# EAGLE design ltc6655LS8_reference_module (EAGLE 7.4.0)
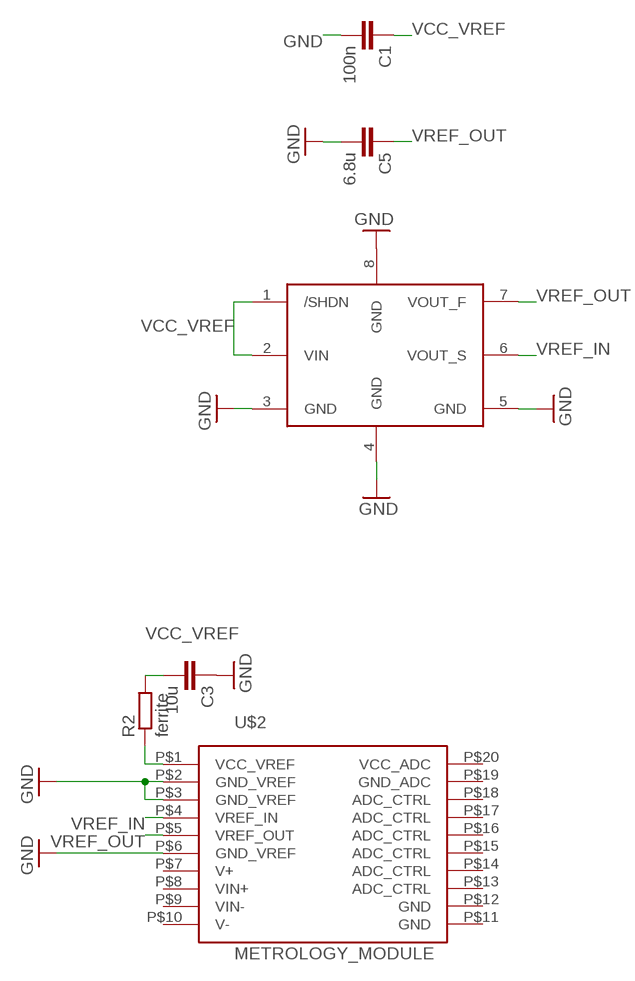
[diagram p0: schematic, sheet 1]

## Parts
C1  100n  C-EUC0603  [C0603]
C3  10u  C-EUC0805  [C0805]
C5  6.8u  C-EU050-085X075W  [C050-085X075W]
R2  ferrite  R-EU_R0805  [R0805]
U$1  LTC6655LS8_ELONG  [LS8_ELONG]
U$2  METROLOGY_MODULE  [METROLOGY_MODULE]

## Nets
GND: C1.2 C3.1 C5.2 U$1.3(GND) U$1.4(GND) U$1.5(GND) U$1.8(GND) U$2.P$2(GND_VREF) U$2.P$3(GND_VREF) U$2.P$6(GND_VREF)
N$1: R2.1 U$2.P$1(VCC_VREF)
VCC_VREF: C1.1 C3.2 R2.2 U$1.1(/SHDN) U$1.2(VIN)
VREF_IN: U$1.6(VOUT_S) U$2.P$4(VREF_IN)
VREF_OUT: C5.1 U$1.7(VOUT_F) U$2.P$5(VREF_OUT)
Unconnected: U$2.P$7(V+) U$2.P$8(VIN+) U$2.P$9(VIN-) U$2.P$10(V-) U$2.P$11(GND) U$2.P$12(GND) U$2.P$13(ADC_CTRL) U$2.P$14(ADC_CTRL) U$2.P$15(ADC_CTRL) U$2.P$16(ADC_CTRL) U$2.P$17(ADC_CTRL) U$2.P$18(ADC_CTRL) U$2.P$19(GND_ADC) U$2.P$20(VCC_ADC)

## Library data of the parts
C1 C3 C5 = SquantorRCL:C-EU: CAPACITOR, European symbol
R2 = SquantorRCL:R-EU_: RESISTOR, European symbol
U$1 = SquantorLinearTechnology:LTC6655
U$2 = SquantorPCBOutline:METROLOGY_MODULE

## Board
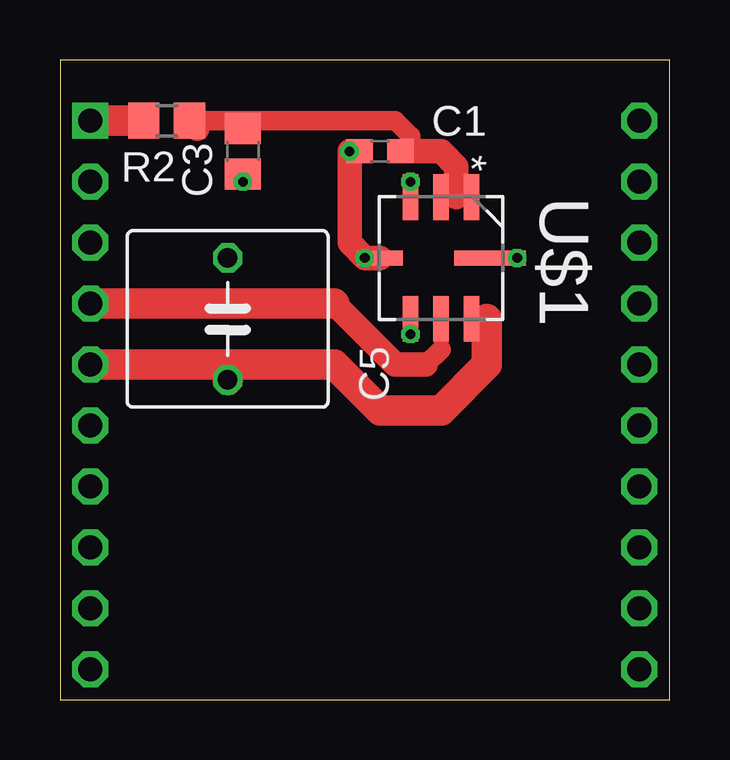
[diagram p1: board, top side]
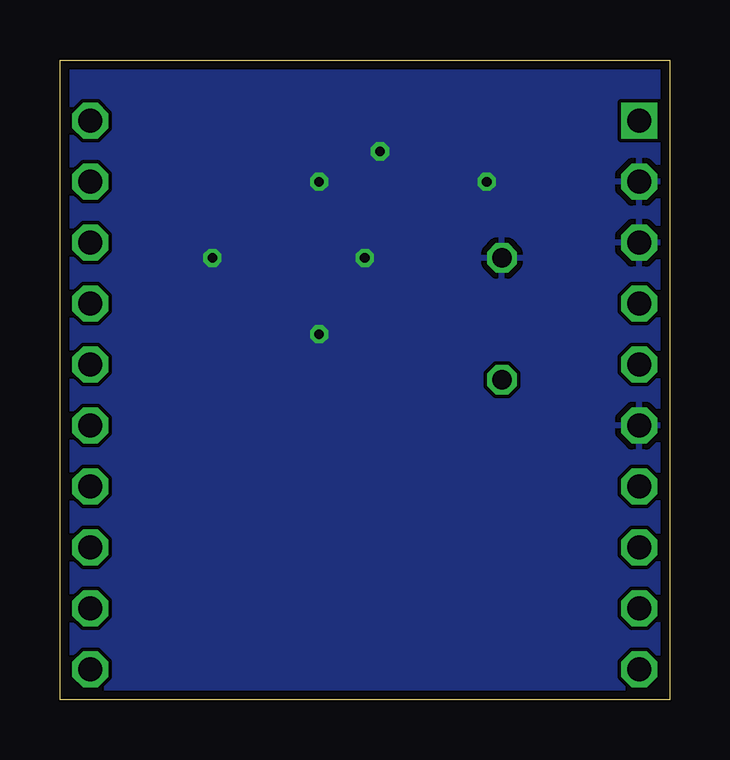
[diagram p2: board, bottom side, seen from below]

Size 25.4 x 26.67 mm. Coordinates in mm from the lower left corner, seen from the top.
Outline: 0,0 25.4,0 25.4,26.67 0,26.67 0,0
Copper layers (1*16): Top 0.0356mm / dielectric 1.5011mm / Bottom 0.0356mm
Design rules "OSHPark": minimum track width 6mil, minimum drill 13mil, track to track 6mil, track to pad 6mil, pad to pad 6mil, via to via 6mil, smd to smd 6mil, copper to edge 15mil, drill to drill 6mil, minimum pad ring 7mil, minimum via ring 7mil, stop-mask expansion 3mil, vias tented up to drill 0mil, thermal gap 10mil

### Footprints (pad centres in the part's own frame; a part is rotated, then mirrored left to right if it is on the bottom)
C0603 = smd 1.1 x 1: 1 -0.85,0; 2 0.85,0
C0805 = smd 1.3 x 1.5: 1 -0.95,0; 2 0.95,0
C050-085X075W = drill 0.813 octagon: 1 -2.54,0; 2 2.54,0
R0805 = smd 1.3 x 1.5: 1 -0.95,0; 2 0.95,0
LS8_ELONG = smd 1.905 x 0.635: 1 -2.54,1.27; 2 -2.54,0; 3 -2.54,-1.27; 5 2.54,-1.27; 6 2.54,0; 7 2.54,1.27 | smd 0.635 x 1.905: 4 0,-2.54 | smd 0.635 x 2.97: 8 0,2.045
METROLOGY_MODULE = drill 1 square: P$1 -11.43,11.43 | drill 1 octagon: P$2 -11.43,8.89; P$3 -11.43,6.35; P$4 -11.43,3.81; P$5 -11.43,1.27; P$6 -11.43,-1.27; P$7 -11.43,-3.81; P$8 -11.43,-6.35; P$9 -11.43,-8.89; P$10 -11.43,-11.43; P$11 11.43,-11.43; P$12 11.43,-8.89; P$13 11.43,-6.35; P$14 11.43,-3.81; P$15 11.43,-1.27; P$16 11.43,1.27; P$17 11.43,3.81; P$18 11.43,6.35; P$19 11.43,8.89; P$20 11.43,11.43

### Placement (x,y rotation side)
C1  13.34,22.86 180 top
C3  7.62,22.86 90 top
C5  6.99,15.88 90 top
R2  4.45,24.13 0 top
U$1  15.88,18.41 270 top
U$2  12.7,12.7 0 top

### Tracks (layer width: path | path; a pad name or v marks a point on that pad's centre or on a via)
GND  (via drill 0.4)
  Top 0.61: U$1.5 v14.61,15.24 | v14.61,21.59 U$1.3 | v19.05,18.41 U$1.8 | C3.1 v7.62,21.59
  Top 0.813: v12.06,22.86 C1.2
  Top 1.016: U$1.4 v12.7,18.41 12.06,19.05 v12.06,22.86
  pour Bottom: 0,26.67 25.4,26.67 25.4,0 0,0
N$1
  Top 1.27: U$2.P$1 R2.1
VCC_VREF
  Top 0.61: U$1.1 16.51,20.95 U$1.2 | C3.2 7.62,24.13
  Top 0.813: 14.61,22.86 14.61,23.5 13.97,24.13 7.62,24.13 R2.2
  Top 1.016: C1.1 14.61,22.86 15.88,22.86 16.51,22.23 16.51,20.95 | 5.71,23.81 R2.2
VREF_IN
  Top 0.61: U$1.6 15.88,14.61
  Top 0.813: 15.88,14.61 15.24,13.97
  Top 1.016: 15.24,13.97 13.97,13.97 11.43,16.51 3.81,16.51
  Top 1.27: U$2.P$4 11.43,16.51
VREF_OUT
  Top 0.61: U$1.7 17.78,15.88
  Top 1.27: U$2.P$5 6.99,13.97 | 6.99,13.97 11.43,13.97 13.34,12.06 15.88,12.06 17.78,13.97 17.78,15.88 | C5.1 6.99,13.97